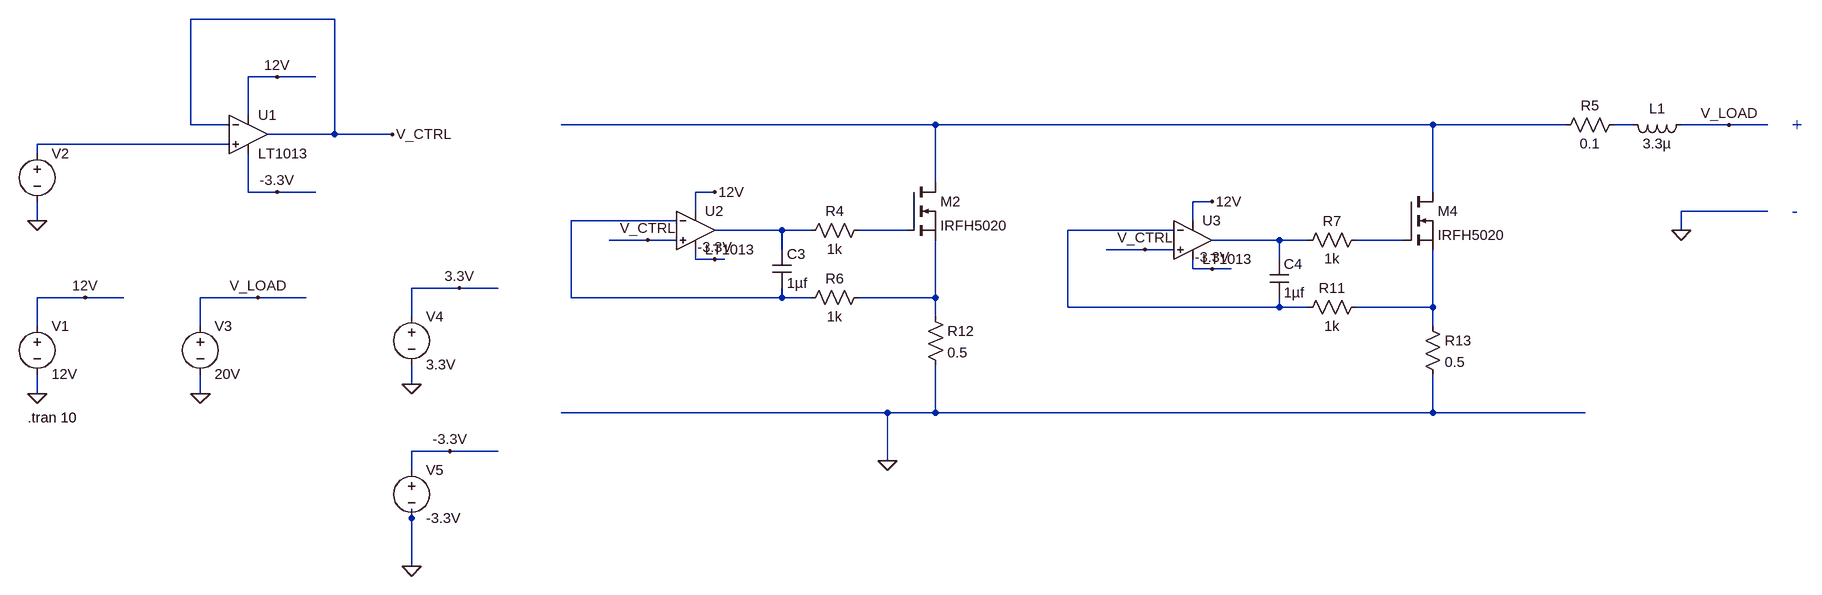
[diagram p0: schematic LOAD.asc]
LOAD.asc, the LTspice schematic file:
Version 4.1
SHEET 1 4468 1684
WIRE 448 -224 208 -224
WIRE 352 -128 304 -128
WIRE 416 -128 352 -128
WIRE 304 -64 304 -128
WIRE 208 -48 208 -224
WIRE 272 -48 208 -48
WIRE 1808 -48 1184 -48
WIRE 2672 -48 1808 -48
WIRE 3104 -48 2672 -48
WIRE 3216 -48 3184 -48
WIRE 3376 -48 3296 -48
WIRE 3440 -48 3376 -48
WIRE 448 -32 448 -224
WIRE 448 -32 336 -32
WIRE 544 -32 448 -32
WIRE 272 -16 -48 -16
WIRE -48 0 -48 -16
WIRE 1808 48 1808 -48
WIRE 304 64 304 0
WIRE 352 64 304 64
WIRE 416 64 352 64
WIRE 1440 64 1408 64
WIRE 2672 64 2672 -48
WIRE 2304 80 2272 80
WIRE 1408 96 1408 64
WIRE 3440 96 3296 96
WIRE -48 112 -48 80
WIRE 1376 112 1200 112
WIRE 2272 112 2272 80
WIRE 1552 128 1440 128
WIRE 1600 128 1552 128
WIRE 1760 128 1680 128
WIRE 2240 128 2064 128
WIRE 3296 128 3296 96
WIRE 1328 144 1264 144
WIRE 1376 144 1328 144
WIRE 2416 144 2304 144
WIRE 2464 144 2416 144
WIRE 2624 144 2544 144
WIRE 1552 160 1552 128
WIRE 2192 160 2128 160
WIRE 2240 160 2192 160
WIRE 1408 176 1408 160
WIRE 1440 176 1408 176
WIRE 1456 176 1440 176
WIRE 2416 176 2416 144
WIRE 2272 192 2272 176
WIRE 2304 192 2272 192
WIRE 2336 192 2304 192
WIRE 656 224 576 224
WIRE 720 224 656 224
WIRE 32 240 -48 240
WIRE 96 240 32 240
WIRE 320 240 224 240
WIRE 400 240 320 240
WIRE 1200 240 1200 112
WIRE 1552 240 1552 224
WIRE 1552 240 1200 240
WIRE 1600 240 1552 240
WIRE 1808 240 1808 144
WIRE 1808 240 1680 240
WIRE 2064 256 2064 128
WIRE 2416 256 2416 240
WIRE 2416 256 2064 256
WIRE 2464 256 2416 256
WIRE 2672 256 2672 160
WIRE 2672 256 2544 256
WIRE 576 272 576 224
WIRE 1808 272 1808 240
WIRE -48 288 -48 240
WIRE 224 288 224 240
WIRE 2672 288 2672 256
WIRE 576 384 576 352
WIRE -48 400 -48 368
WIRE 224 400 224 368
WIRE 1728 432 1184 432
WIRE 1808 432 1808 352
WIRE 1808 432 1728 432
WIRE 2672 432 2672 368
WIRE 2672 432 1808 432
WIRE 3136 432 2672 432
WIRE 640 496 576 496
WIRE 720 496 640 496
WIRE 1728 512 1728 432
WIRE 576 528 576 496
WIRE 576 608 576 592
WIRE 576 688 576 608
FLAG -48 112 0
FLAG -48 400 0
FLAG 224 400 0
FLAG 32 240 12V
FLAG 320 240 V_LOAD
FLAG 3296 128 0
FLAG 544 -32 V_CTRL
FLAG 3376 -48 V_LOAD
FLAG 1440 64 12V
FLAG 1328 144 V_CTRL
FLAG 2304 80 12V
FLAG 2192 160 V_CTRL
FLAG 1728 512 0
FLAG 576 384 0
FLAG 656 224 3.3V
FLAG 576 688 0
FLAG 640 496 -3.3V
FLAG 352 64 -3.3V
FLAG 1440 176 -3.3V
FLAG 2304 192 -3.3V
FLAG 352 -128 12V
SYMBOL voltage -48 -16 R0
WINDOW 123 0 0 Left 0
WINDOW 39 0 0 Left 0
WINDOW 3 24 96 Invisible 2
SYMATTR InstName V2
SYMATTR Value PWL(0 0 1 0 1.001 0.33 2 0.33 2.001 0.66 3 0.66 3.001 0.99 4 0.99 4.001 1.32 5 1.32 5.001 1.65 6 1.65 6.001 1.98 7 1.98 7.001 2.31 8 2.31 8.001 2.64 9 2.64 9.001 2.97 10 2.97 10.001 3.3)
SYMBOL voltage -48 272 R0
WINDOW 123 0 0 Left 0
WINDOW 39 0 0 Left 0
SYMATTR InstName V1
SYMATTR Value 12V
SYMBOL voltage 224 272 R0
WINDOW 123 0 0 Left 0
WINDOW 39 0 0 Left 0
SYMATTR InstName V3
SYMATTR Value 20V
SYMBOL res 3200 -64 R90
WINDOW 0 0 56 VBottom 2
WINDOW 3 32 56 VTop 2
SYMATTR InstName R5
SYMATTR Value 0.1
SYMBOL ind 3312 -64 R90
WINDOW 0 5 56 VBottom 2
WINDOW 3 32 56 VTop 2
SYMATTR InstName L1
SYMATTR Value 3.3µ
SYMBOL nmos 1760 48 R0
SYMATTR InstName M2
SYMATTR Value IRFH5020
SYMBOL res 1696 112 R90
WINDOW 0 0 56 VBottom 2
WINDOW 3 32 56 VTop 2
SYMATTR InstName R4
SYMATTR Value 1k
SYMBOL res 1696 224 R90
WINDOW 0 0 56 VBottom 2
WINDOW 3 32 56 VTop 2
SYMATTR InstName R6
SYMATTR Value 1k
SYMBOL cap 1536 160 R0
SYMATTR InstName C3
SYMATTR Value 1µf
SYMBOL nmos 2624 64 R0
SYMATTR InstName M4
SYMATTR Value IRFH5020
SYMBOL res 2560 128 R90
WINDOW 0 0 56 VBottom 2
WINDOW 3 32 56 VTop 2
SYMATTR InstName R7
SYMATTR Value 1k
SYMBOL res 2560 240 R90
WINDOW 0 0 56 VBottom 2
WINDOW 3 32 56 VTop 2
SYMATTR InstName R11
SYMATTR Value 1k
SYMBOL cap 2400 176 R0
SYMATTR InstName C4
SYMATTR Value 1µf
SYMBOL res 1792 256 R0
SYMATTR InstName R12
SYMATTR Value 0.5
SYMBOL res 2656 272 R0
SYMATTR InstName R13
SYMATTR Value 0.5
SYMBOL voltage 576 256 R0
WINDOW 123 0 0 Left 0
WINDOW 39 0 0 Left 0
SYMATTR InstName V4
SYMATTR Value 3.3V
SYMBOL voltage 576 512 R0
WINDOW 123 0 0 Left 0
WINDOW 39 0 0 Left 0
SYMATTR InstName V5
SYMATTR Value -3.3V
SYMBOL OpAmps\\LT1013 304 -96 R0
SYMATTR InstName U1
SYMBOL OpAmps\\LT1013 1408 64 R0
SYMATTR InstName U2
SYMBOL OpAmps\\LT1013 2272 80 R0
SYMATTR InstName U3
TEXT -64 440 Left 2 !.tran 10
TEXT 3480 -48 Left 3 ;+
TEXT 3480 96 Left 3 ;-

The netlist it stands for:
* LOAD.asc
V2 N003 0 PWL(0 0 1 0 1.001 0.33 2 0.33 2.001 0.66 3 0.66 3.001 0.99 4 0.99 4.001 1.32 5 1.32 5.001 1.65 6 1.65 6.001 1.98 7 1.98 7.001 2.31 8 2.31 8.001 2.64 9 2.64 9.001 2.97 10 2.97 10.001 3.3)
V1 12V 0 12V
V3 V_LOAD 0 20V
R5 N002 N001 0.1
L1 V_LOAD N002 3.3µ
M2 N001 N006 N010 N010 IRFH5020
R4 N006 N005 1k
R6 N010 N004 1k
C3 N005 N004 1µf
M4 N001 N009 N011 N011 IRFH5020
R7 N009 N008 1k
R11 N011 N007 1k
C4 N008 N007 1µf
R12 N010 0 0.5
R13 N011 0 0.5
V4 3.3V 0 3.3V
V5 -3.3V 0 -3.3V
X§U1 N003 V_CTRL 12V -3.3V V_CTRL LT1013  ; pins In+ In- V+ V- OUT
X§U2 V_CTRL N004 12V -3.3V N005 LT1013  ; pins In+ In- V+ V- OUT
X§U3 V_CTRL N007 12V -3.3V N008 LT1013  ; pins In+ In- V+ V- OUT
.model NMOS NMOS
.model PMOS PMOS
.lib standard.mos
.tran 10
* +
* -
.lib LTC.lib
.backanno
.end